# Altium project RANGE-FINDER-NODE.PrjPcb
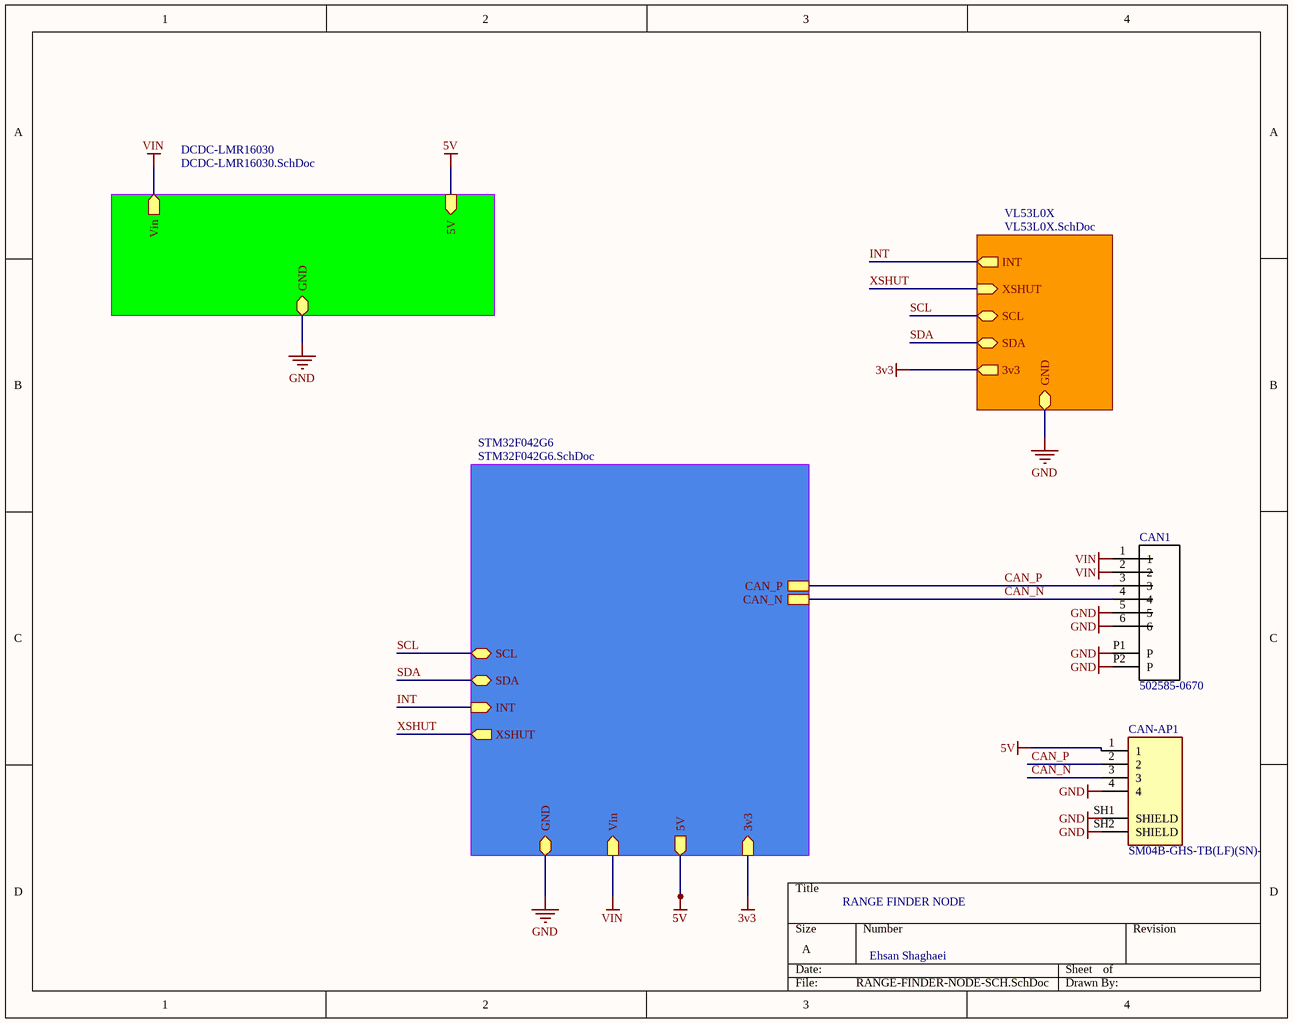
[diagram p0: RANGE-FINDER-NODE-SCH.SchDoc]
4 sheets, 45 parts. Net scope: hierarchical (ports join the sheet entries above them; power ports are global).
Board file: RANGE-FINDER-NODE-PCB.PcbDoc
Sheets:
  RANGE-FINDER-NODE-SCH.SchDoc
    STM32F042G6 = STM32F042G6.SchDoc
    DCDC-LMR16030 = DCDC-LMR16030.SchDoc
    VL53L0X = VL53L0X.SchDoc

## Sheet RANGE-FINDER-NODE-SCH.SchDoc: RANGE FINDER NODE
size A; Engineer: Ehsan Shaghaei; SheetNumber: 1; SheetTotal: 4

### Parts
CAN1  502585-0670  [MOLEX_502585-0670]
CAN-AP1  SM04B-GHS-TB(LF)(SN)-  [JST_SM04B-GHS-TB(LF)(SN)-]

### Sub-sheets
DCDC-LMR16030 = DCDC-LMR16030.SchDoc: GND (bidir), Vin (out), 5V (in)
STM32F042G6 = STM32F042G6.SchDoc: GND (bidir), Vin (in), 5V (out), 3v3 (in), SDA (bidir), SCL (bidir), XSHUT (out), INT (in), CAN_P, CAN_N
VL53L0X = VL53L0X.SchDoc: GND (bidir), 3v3 (out), SDA (bidir), SCL (bidir), XSHUT (in), INT (out)

### Nets
3v3: sheet STM32F042G6/3v3, sheet VL53L0X/3v3  [project net 3.3]
5V: CAN-AP1.1 ; sheet STM32F042G6/5V, sheet DCDC-LMR16030/5V
GND: CAN1.5 CAN1.6 CAN1.P1(P) CAN1.P2(P) CAN-AP1.4 CAN-AP1.SH1(SHIELD) CAN-AP1.SH2(SHIELD) ; sheet STM32F042G6/GND, sheet DCDC-LMR16030/GND, sheet VL53L0X/GND
Vin: CAN1.1 CAN1.2 ; sheet STM32F042G6/Vin, sheet DCDC-LMR16030/Vin
CAN_N: CAN1.4 CAN-AP1.3 ; sheet STM32F042G6/CAN_N
CAN_P: CAN1.3 CAN-AP1.2 ; sheet STM32F042G6/CAN_P
INT: sheet STM32F042G6/INT, sheet VL53L0X/INT
SCL: sheet STM32F042G6/SCL, sheet VL53L0X/SCL
SDA: sheet STM32F042G6/SDA, sheet VL53L0X/SDA
XSHUT: sheet STM32F042G6/XSHUT, sheet VL53L0X/XSHUT

### Library data of the parts
CAN1 = 502585-0670: 1.50mm Pitch, CLIK-Mate PCB Receptacle, Single Row, Surface Mount, Right-Angle, Tin Plating, Positive Lock, 6 Circuits, Natural; MF: Molex; System: Connector; MP: 502585-0670; Package: None; SnapEDA_Link: https://www.snapeda.com/parts/502494-0670/Molex/view-part/?ref=snap; Value: *; Type: SMD
CAN-AP1 = SM04B-GHS-TB(LF)(SN)-: Connector Header Surface Mount, Right Angle 4 position 0.049 _1.25mm_; MF: JST Sales; MP: SM04B-GHS-TB(LF)(SN); Package: None; Value: *; SnapEDA_Link: https://www.snapeda.com/parts/SM04B-GHS-TB%28LF%29%28SN%29-/JST%20Sales%20America%20Inc./view-part/2759740/?ref=snap; HelpURL: http://www.farnell.com/datasheets/2082975.pdf; System: Connector; ChipDip_Link: https://www.chipdip.ru/product/sm04b-ghs-tb-lf-sn-gh-1.25mm-header-side-ent

## Sheet STM32F042G6.SchDoc: STM32F042G6 Schematics
size A3; Revision: 2; SheetNumber: 3; SheetTotal: 4; Version: 1
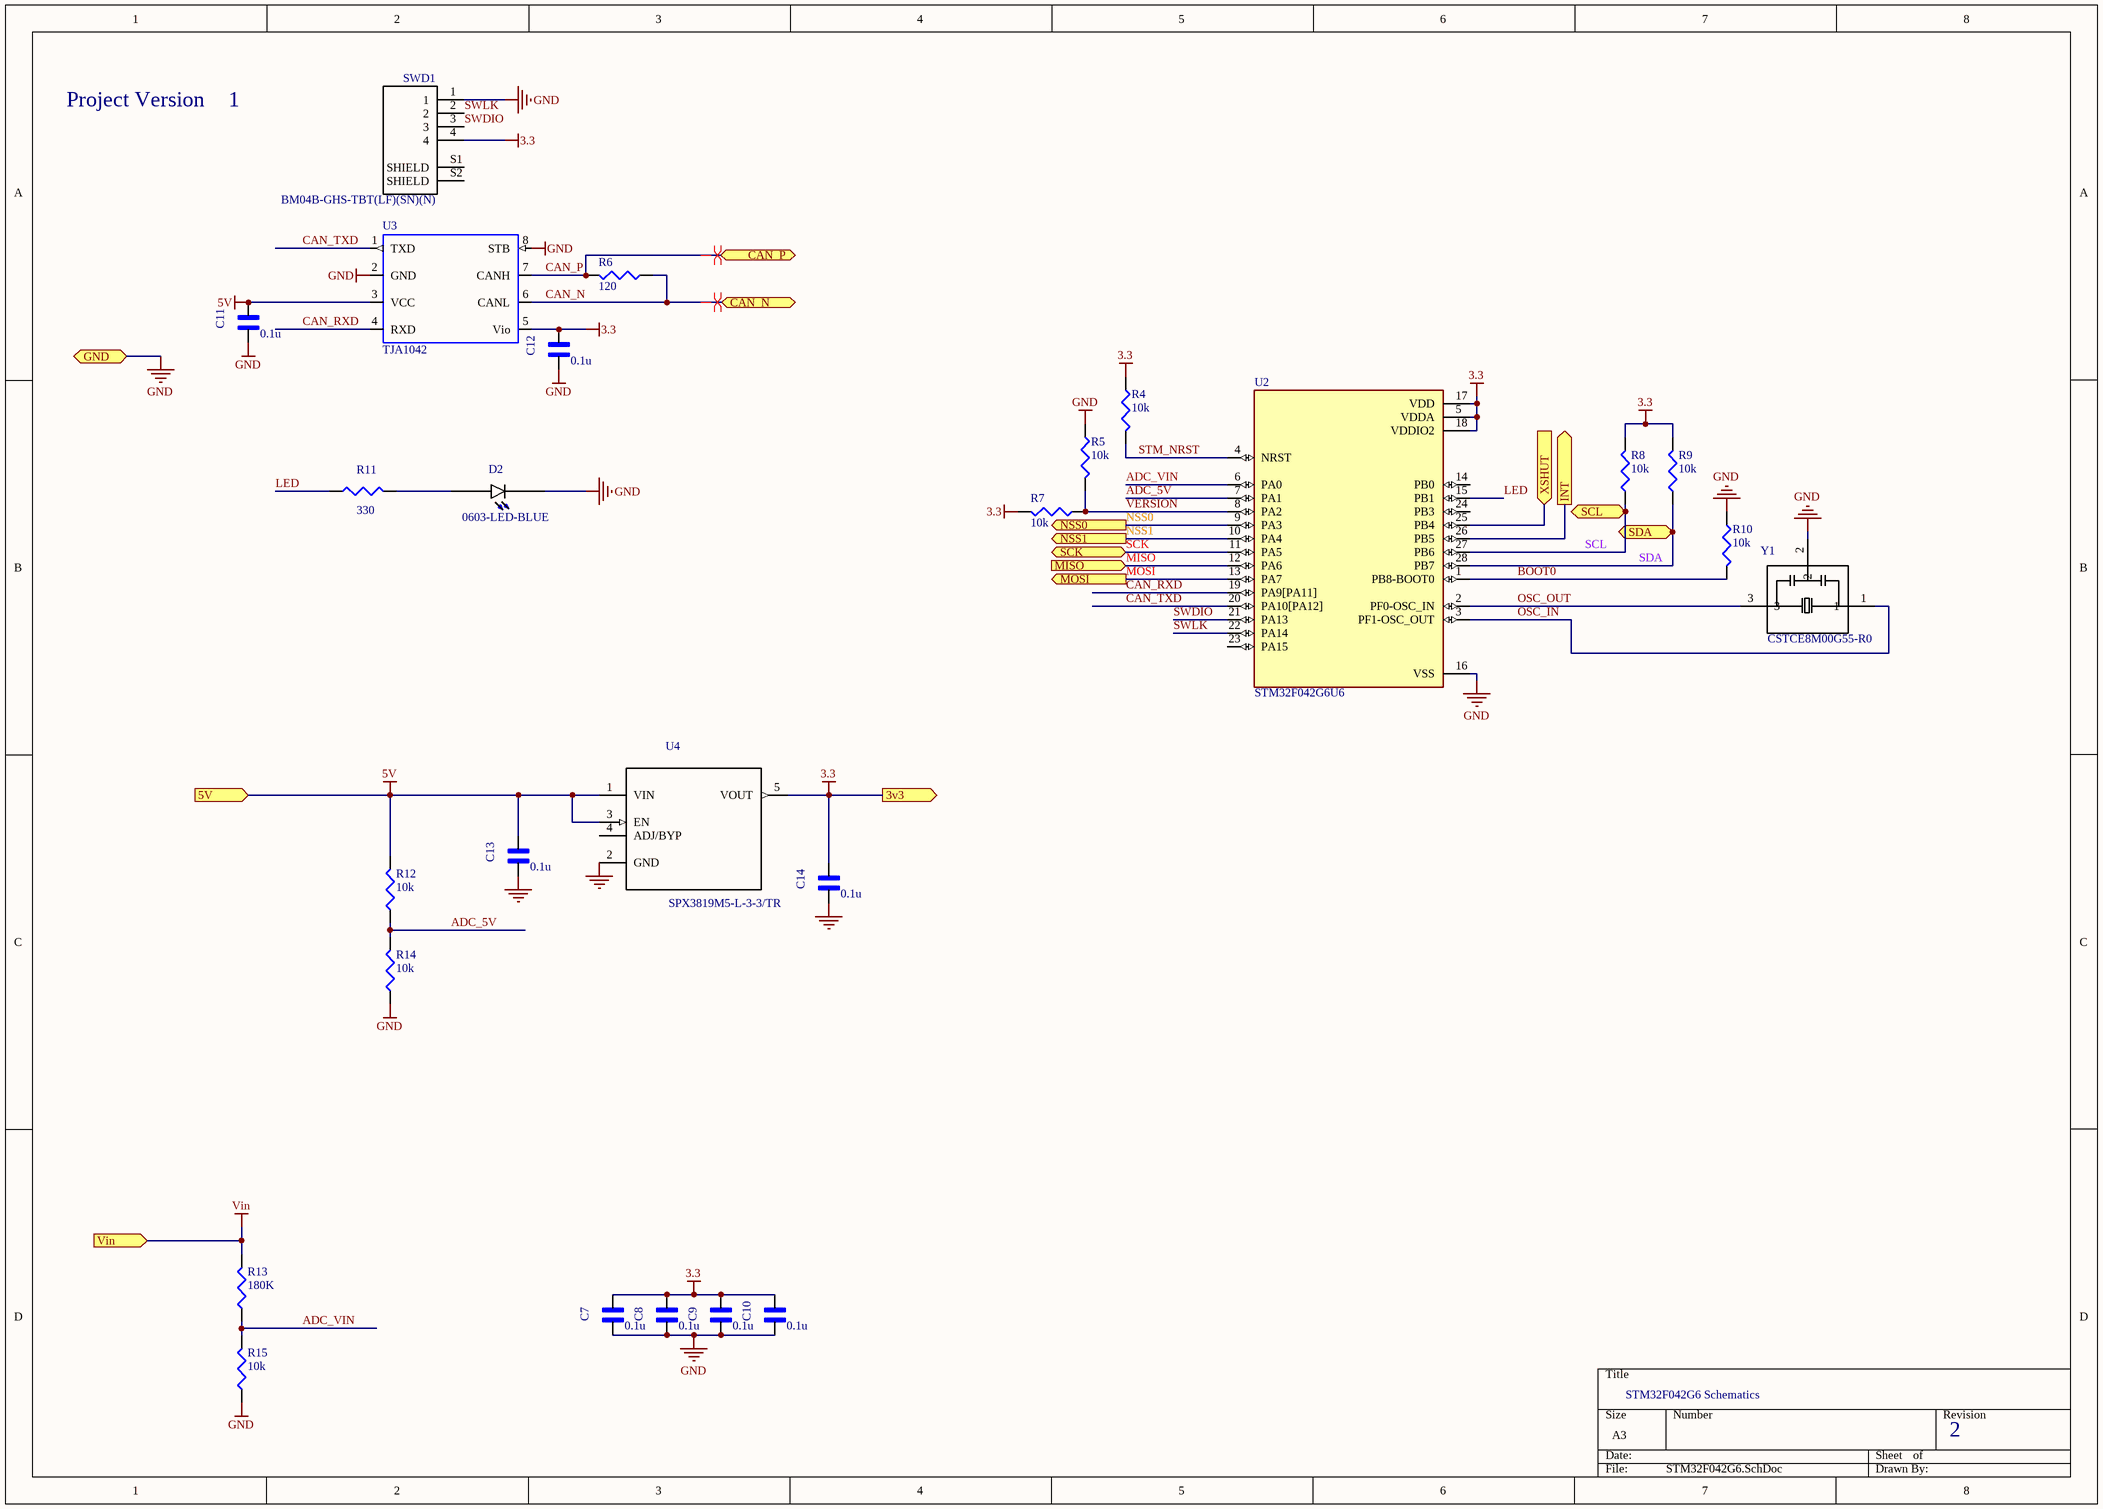
[diagram p1: STM32F042G6.SchDoc]

### Parts
C7  value 0.1u  [*CAPC1608X90]  (hidden comment: GX035C104MAT2-500)
C8  value 0.1u  [*CAPC1608X90]  (hidden comment: GX035C104MAT2-500)
C9  value 0.1u  [*CAPC1608X90]  (hidden comment: GX035C104MAT2-500)
C10  value 0.1u  [*CAPC1608X90]  (hidden comment: GX035C104MAT2-500)
C11  value 0.1u  [*CAPC1608X90]  (hidden comment: GX035C104MAT2-500)
C12  value 0.1u  [*CAPC1608X90]  (hidden comment: GX035C104MAT2-500)
C13  value 0.1u  [*CAPC1608X90]  (hidden comment: GX035C104MAT2-500)
C14  value 0.1u  [*CAPC1608X90]  (hidden comment: GX035C104MAT2-500)
D2  0603-LED-BLUE  [*LEDM1608X80_LTE-C1906R-14(Primary)]
R4  value 10k  [J1-0603]  (hidden comment: RC0603FR-0710KL)
R5  value 10k  [J1-0603]  (hidden comment: RC0603FR-0710KL)
R6  value 120  [J1-0603]  (hidden comment: Res3)
R7  value 10k  [J1-0603]  (hidden comment: RC0603FR-0710KL)
R8  value 10k  [J1-0603]  (hidden comment: RC0603FR-0710KL)
R9  value 10k  [J1-0603]  (hidden comment: RC0603FR-0710KL)
R10  value 10k  [J1-0603]  (hidden comment: RC0603FR-0710KL)
R11  value 330  [J1-0603]  (hidden comment: Res3)
R12  value 10k  [J1-0603]  (hidden comment: RC0603FR-0710KL)
R13  value 180K  [J1-0603]  (hidden comment: RC0603FR-0710KL)
R14  value 10k  [J1-0603]  (hidden comment: RC0603FR-0710KL)
R15  value 10k  [J1-0603]  (hidden comment: RC0603FR-0710KL)
SWD1  BM04B-GHS-TBT(LF)(SN)(N)  [JST_PAD]
U2  STM32F042G6U6  [STM32F042G6U6_UFQFPN4x4]
U3  TJA1042  [SOT782-1]
U4  SPX3819M5-L-3-3/TR  [*SOT95P280X145-5N]
Y1  CSTCE8M00G55-R0  [*OSC_CSTCE8M00G55-R0]

### Ports
3v3 (out), 5V (in), CAN_N (bidir), CAN_P (bidir), GND (bidir), INT (out), MISO (in), MOSI (out), NSS0 (out), NSS1 (out), SCK (bidir), SCL (bidir), SDA (bidir), Vin (in), XSHUT (in)

### Nets
3.3: C7.1 C8.1 C9.1 C10.1 C12.1 C14.1 R4.1 R7.2 R8.2 R9.2 SWD1.4 U2.5(VDDA) U2.17(VDD) U2.18(VDDIO2) U3.5(Vio) U4.5(VOUT) ; port 3v3
5V: C11.1 C13.1 R12.2 U3.3(VCC) U4.1(VIN) U4.3(EN) ; port 5V
GND: C7.2 C8.2 C9.2 C10.2 C11.2 C12.2 C13.2 C14.2 D2.C R5.1 R10.1 R14.1 R15.1 SWD1.1 U2.16(VSS) U3.2(GND) U3.8(STB) U4.2(GND) Y1.2 ; port GND
Vin: R13.2 ; port Vin
ADC_5V: R12.1 R14.2 U2.7(PA1)
ADC_VIN: R13.1 R15.2 U2.6(PA0)
BOOT0: R10.2 U2.1(PB8-BOOT0)
CAN_N: R6.1 U3.6(CANL) ; port CAN_N
CAN_P: R6.2 U3.7(CANH) ; port CAN_P
CAN_RXD: U2.19(PA9[PA11]) U3.4(RXD)
CAN_TXD: U2.20(PA10[PA12]) U3.1(TXD)
INT: U2.26(PB5) ; port INT
LED: R11.1 U2.15(PB1)
MISO: U2.12(PA6) ; port MISO
MOSI: U2.13(PA7) ; port MOSI
NSS0: U2.9(PA3) ; port NSS0
NSS1: U2.10(PA4) ; port NSS1
OSC_IN: U2.3(PF1-OSC_OUT) Y1.1
OSC_OUT: U2.2(PF0-OSC_IN) Y1.3
SCK: U2.11(PA5) ; port SCK
SCL: R8.1 U2.27(PB6) ; port SCL
SDA: R9.1 U2.28(PB7) ; port SDA
STM_NRST: R4.2 U2.4(NRST)
SWDIO: SWD1.3 U2.21(PA13)
SWLK: SWD1.2 U2.22(PA14)
VERSION: R5.2 R7.1 U2.8(PA2)
XSHUT: U2.25(PB4) ; port XSHUT
NetD2_A: D2.A R11.2

Not connected (* = marked no-connect by the designer): SWD1 S1(SHIELD) S2(SHIELD); U2 14(PB0) 23(PA15) 24(PB3); U4 4(ADJ/BYP)

### Layout directives
differential pair: CAN_N, CAN_P

### Notes on the sheet
- Project Version

### Library data of the parts
C7-C12 = GX035C104MAT2-500: Cap Thin Film 0.1uf 50v 0603; MF: AVX; MP: GX035C104MAT2-500 or CL10B104JB8NNNC; Pacage Metric: 1608; Type: SMD; Package: 0603 AVX; SnapEDA_Link: https://www.snapeda.com/parts/GX035C104MAT2-500/AVX/view-part/?ref=snap
C13 C14 = GX035C104MAT2-500: Cap Thin Film 0.1uf 50v 0603; MF: AVX; Pacage Metric: 1608; Type: SMD; Package: 0603 AVX; MP: GX035C104MAT2-500; SnapEDA_Link: https://www.snapeda.com/parts/GX035C104MAT2-500/AVX/view-part/?ref=snap
D2 = LTE-C1906R-14: LED IrLED Chip LED 2-Pin SMD T/R; Package: 0603 Lite-On; MP: 0603-LED-BLUE; SnapEDA_Link: https://www.snapeda.com/parts/LTE-C1906R-14/Lite-On%20Inc./view-part/?ref=snap; Value: *; Type: SMD
R4 R5 R7-R10 R12-R15 = RC0603FR-0710KL: 10 kOhms 1 0.1 W 1 10 W Chip Resistor 0603 1608 Metric Thick Film; Pacage Metric: 1608; MF: Yageo or NXP; MP: 10K 1% 0603; ChipDip_Link: https://www.chipdip.ru/product0/9000079736; HelpURL: https://www.chipdip.ru/product0/9000079736; Package: R0603; Type: SMD; SnapEDA_Link: https://www.snapeda.com/parts/RC0603FR-0710KL/Yageo/view-part/?ref=dk&t=RC0603FR-0710KL&con_ref=None
R6 = Res3: 120 Ohms 1 0.1 W 1 10 W Chip Resistor 0603 1608 Metric Thick Film; Pacage Metric: 1608; MP: RC0603FR-07120RL; ChipDip_Link: https://www.chipdip.ru/product0/9000079618; HelpURL: https://www.chipdip.ru/product0/9000079618; Package: R0603; Type: SMD
R11 = Res3: Resistor; Pacage Metric: 1608; MP: RC0603FR-07330RL; ChipDip_Link: https://www.chipdip.ru/product0/9000079628; HelpURL: https://www.chipdip.ru/product0/9000079628; Package: R0603; Type: SMD
SWD1 = BM04B-GHS-TBT(LF)(SN)(N): Conn Shrouded Header HDR 4 POS 1.25mm Solder ST SMD Reel; MF: JST Sales; MP: SM04B-GHS-TB(LF)(SN); Instructions: Do not install; System: Connector; SnapEDA_Link: https://www.snapeda.com/parts/BM04B-GHS-TBT%28LF%29%28SN%29%28N%29/JST%20Sales%20America%20Inc./view-part/?ref=snap; Package: None; Value: *; Type: SMD
U2 = STM32F042G6U6: ARMÂ® CortexÂ®-M0 STM32F0 Microcontroller IC 32-Bit 48MHz 32KB _32K x 8_ FLASH 28-UFQFPN _4x4_; MF: STMicroelectronics; designer: Ehsan Shaghaei; Package: UFQFN-28 STMicroelectronics; Availability: Unavailable; SnapEDA_Link: https://www.snapeda.com/parts/STM32F042G6U6/STMicroelectronics/view-part/225452/?ref=snap; MP: STM32F042G6U6; Price: None; Value: *; datasheet: https://static.chipdip.ru/lib/914/DOC005914773.pdf; chipdip_link: https://www.chipdip.ru/product/stm32f042g6u6
U3 = TJA1042: 1/1 Transceiver Half CANbus 8-SO; MF: NXP USA; SnapEDA_Link: https://www.snapeda.com/parts/TJA1042/NXP%20USA%20Inc./view-part/900919/?ref=snap; Value: *; MP: TJA1042; Package: VDFN-8 NXP USA; ChipDip_Link: https://www.chipdip.ru/product1/8002840332; HelpURL: https://static.chipdip.ru/lib/583/DOC001583059.pdf; Type: SMD
U4 = SPX3819M5-L: Low Dropout Voltage Regulator, Adjustable 0.5A, В±1%, 2.5 to 16 Vin, 5-Pin SOT-23; MF: MaxLinear, Inc.; Value: 3V3; MP: SPX3819M5-L-3-3/TR; Package: SOT-23-5 Exar; SnapEDA_Link: https://www.snapeda.com/parts/SPX3819M5-L/MaxLinear%2C%20Inc./view-part/?ref=snap; Type: SMD; ChipDip_Link: https://www.chipdip.ru/product1/8003455237; HelpURL: http://www.farnell.com/datasheets/2614478.pdf
Y1 = CSTCE8M00G55-R0: Ceramic Resonator 8MHz ??0.5% _Tol_ ??0.2% _Stability_ 33pF 40Ohm 3-Pin CSMD T/R; MF: Murata; MP: CSTCE8M00G55-R0; Package: SMD-3 Murata; SnapEDA_Link: https://www.snapeda.com/parts/CSTCE8M00G55-R0/Murata%20Electronics%20North%20America/view-part/?ref=snap; Value: *; ChipDip_Link: https://www.chipdip.ru/product1/8001783721; HelpURL: https://www.murata.com/en-eu/api/pdfdownloadapi?cate=&partno=CSTCE8M00G55-R0; Type: SMD

## Sheet DCDC-LMR16030.SchDoc
size A3; Revision: 8; SheetNumber: 2; SheetTotal: 4
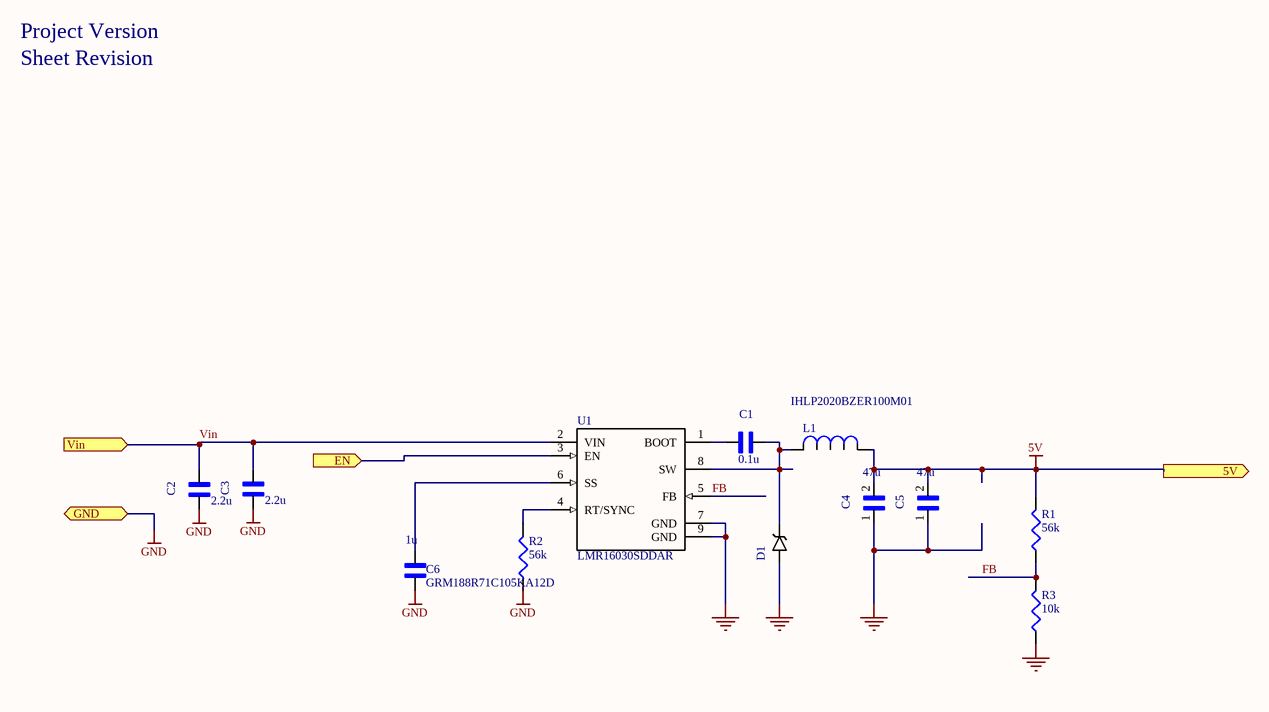
[diagram p2: DCDC-LMR16030.SchDoc]

### Parts
C1  value 0.1u  [*CAPC1608X90]  (hidden comment: GX035C104MAT2-500)
C2  value 2.2u  [*CAP3216X125N]  (hidden comment: GRM31CR71H225KA88L)
C3  value 2.2u  [*CAP3216X125N]  (hidden comment: GRM31CR71H225KA88L)
C4  value 47u  [*CAPC3216X125N]  (hidden comment: GRM31CR61A476KE15L)
C5  value 47u  [*CAPC3216X125N]  (hidden comment: GRM31CR61A476KE15L)
C6  GRM188R71C105KA12D  value 1u  [CAPC1608X90N]
D1  SK56  [*SMB_P6SMB62AT3G(Primary)]  (value not drawn)
L1  IHLP2020BZER100M01  [IHLP]
R1  value 56k  [J1-0603]  (hidden comment: Res3)
R2  value 56k  [J1-0603]  (hidden comment: Res3)
R3  value 10k  [J1-0603]  (hidden comment: RC0603FR-0710KL)
U1  LMR16030SDDAR  [*SOIC127P600X170-9N - duplicate]

### Ports
5V (out), EN (in), GND (bidir), Vin (in)

### Nets
5V: C4.2 C5.2 L1.1 R1.2 ; port 5V
GND: C2.2 C3.2 C4.1 C5.1 C6.1 D1.A R2.1 R3.1 U1.7(GND) U1.9(GND) ; port GND
Vin: C2.1 C3.1 U1.2(VIN) ; port Vin
FB: R1.1 R3.2 U1.5(FB)
NetC1_1: C1.1 D1.C L1.2 U1.8(SW)
NetC1_2: C1.2 U1.1(BOOT)
NetC6_2: C6.2 U1.6(SS)
NetR2_2: R2.2 U1.4(RT/SYNC)
NetU1_3: U1.3(EN) ; port EN

### Notes on the sheet
- Project Version
- Sheet Revision

### Library data of the parts
C1 = GX035C104MAT2-500: as C7 on sheet STM32F042G6; Package: 0603 AVX; SnapEDA_Link: https://www.snapeda.com/parts/GX035C104MAT2-500/AVX/view-part/?ref=snap
C2 C3 = GRM31CR71H225KA88L: 1206 2.2 uF 50 V В±10% Tolerance X7R SMT Multilayer Ceramic Capacitor; MF: Murata Electronics; Type: SMD; Package: 1206 Murata; SnapEDA_Link: https://www.snapeda.com/parts/GRM31CR71H225KA88L/Murata%20Electronics%20North%20America/view-part/?ref=snap; MP: GRM31CR71H225KA88L
C4 C5 = GRM31CR61A476KE15L: Multilayer Ceramic Capacitor, GRM Series, 47 - F, - 10%, X5R, 10 V, 1206 [3216 Metric]; MF: Murata Electronics; Type: SMD; Package: 1206 Murata Electronics; MP: GRM31CR61A476KE15L; SnapEDA_Link: https://www.snapeda.com/parts/GRM31CR61A476KE15L/Murata%20Electronics%20North%20America/view-part/?ref=snap
C6 = GRM188R71C105KA12D: SMD Capacitor X7R(EIA) with Capacitance: 1.0uF Tol. 10%. Rated Voltage: 16Vdc; MF: Murata Electronics; Pacage Metric: 1608; MP: GRM188R71C105KA12D; SnapEDA_Link: https://www.snapeda.com/parts/GRM188R71C105KA12D/Murata%20Electronics%20North%20America/view-part/228340/?ref=snap; Package: 0603; ChipDip_Link: https://www.chipdip.ru/product/grm188r71c105ka12d; HelpURL: https://static.chipdip.ru/lib/428/DOC005428493.pdf; Type: SMD
D1 = SK56: Диод Шоттки 5А 60В [SMB / DO-214AA]; MF: Littelfuse Inc.; Type: SMD; MP: SK56; Package: DO-214 Littelfuse; SnapEDA_Link: https://www.snapeda.com/parts/P6SMB62AT3G/Littelfuse%20Inc./view-part/?ref=snap; Value: *; ChipDip_Link: https://www.chipdip.ru/product/sk56
L1 = IHLP2020BZER100M01: 10ÂµH Shielded Molded Inductor 2.3A 199mOhm Max Nonstandard; MF: Vishay Dale; Type: SMD; SnapEDA_Link: https://www.snapeda.com/parts/IHLP2020BZER100M01/Vishay%20Dale/view-part/44808/?ref=snap; MP: IHLP2020BZER100M01; Value: *; Package: Nonstandard Vishay; HelpURL: http://www.vishay.com/docs/34253/ihlp-2020bz-01.pdf; ChipDip_Link: https://www.chipdip.ru/product/ihlp2020bzer100m11-inductor-ihlp-smd-2020-10
R1 R2 = Res3: Resistor; Pacage Metric: 1608; MP: RC0603FR-0756KL; ChipDip_Link: https://www.chipdip.ru/product0/9000079754; HelpURL: https://www.chipdip.ru/product0/9000079754; Package: R0603; Type: SMD
R3 = RC0603FR-0710KL: as R4 on sheet STM32F042G6; ChipDip_Link: https://www.chipdip.ru/product0/9000079736; HelpURL: https://www.chipdip.ru/product0/9000079736; Package: R0603; Type: SMD; SnapEDA_Link: https://www.snapeda.com/parts/RC0603FR-0710KL/Yageo/view-part/?ref=dk&t=RC0603FR-0710KL&con_ref=None
U1 = LMR16030SDDAR: LMR16030SDDAR, Conv DC-DC 4.3V to 60V Step Down Single-Out 1V to 50V 3A Automotive 8-Pin HSOP EP T/R; MF: Texas Instruments; SnapEDA_Link: https://www.snapeda.com/parts/TPS54560DDA/Texas%20Instruments/view-part/?ref=snap; MP: LMR16030SDDAR; Package: PowerSOIC-8 Texas Instruments; Value: *; Type: SMD; ChipDip_Link: https://www.chipdip.ru/product1/8003448566; HelpURL: https://www.ti.com/lit/ds/symlink/lmr16030.pdf

## Sheet VL53L0X.SchDoc
size A; Author: Ehsan Shaghaei; Engineer: Ehsan Shaghaei; Organization: Innopolis University; SheetNumber: 4; SheetTotal: 4
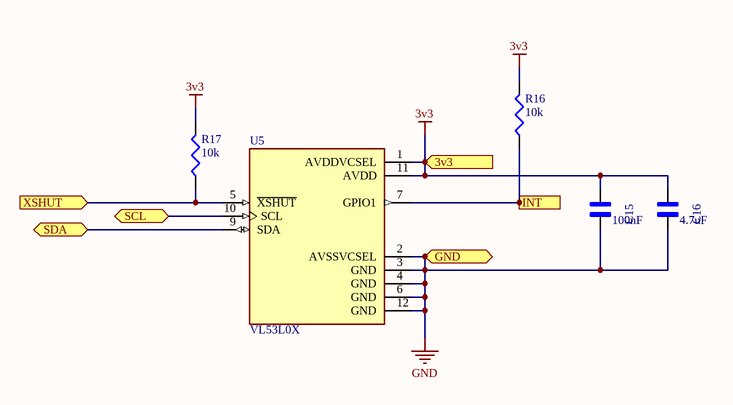
[diagram p3: VL53L0X.SchDoc]

### Parts
C15  value 100nF  [*CAPC1608X90]  (hidden comment: GX035C104MAT2-500)
C16  value 4.7uF  [*CAPC1608X90]  (hidden comment: GX035C104MAT2-500)
R16  value 10k  [J1-0603]  (hidden comment: RC0603FR-0710KL)
R17  value 10k  [J1-0603]  (hidden comment: RC0603FR-0710KL)
U5  VL53L0X  [SENSOR_VL53L0X]

### Ports
3v3 (in), GND (bidir), INT (out), SCL (bidir), SDA (bidir), XSHUT (in)

### Nets
3v3: C15.2 C16.2 R16.2 R17.2 U5.1(AVDDVCSEL) U5.11(AVDD) ; port 3v3  [project net 3.3]
GND: C15.1 C16.1 U5.2(AVSSVCSEL) U5.3(GND) U5.4(GND) U5.6(GND) U5.12(GND) ; port GND
INT: R16.1 U5.7(GPIO1) ; port INT
SCL: U5.10(SCL) ; port SCL
SDA: U5.9(SDA) ; port SDA
XSHUT: R17.1 U5.5(~{XSHUT}) ; port XSHUT

### Library data of the parts
C15 C16 = GX035C104MAT2-500: as C7 on sheet STM32F042G6; Package: 0603 AVX; SnapEDA_Link: https://www.snapeda.com/parts/GX035C104MAT2-500/AVX/view-part/?ref=snap
R16 R17 = RC0603FR-0710KL: as R4 on sheet STM32F042G6; ChipDip_Link: https://www.chipdip.ru/product0/9000079736; HelpURL: https://www.chipdip.ru/product0/9000079736; Package: R0603; Type: SMD; SnapEDA_Link: https://www.snapeda.com/parts/RC0603FR-0710KL/Yageo/view-part/?ref=dk&t=RC0603FR-0710KL&con_ref=None
U5 = VL53L0X: VL53L0X - Light, 3D Time-of-Flight _ToF_ Sensor Evaluation Board; MF: STMicroelectronics; designer: Ehsan Shaghaei; MP: VL53L0X; Package: None; Price: None; Availability: Unavailable; SnapEDA_Link: https://www.snapeda.com/parts/VL53L0X/STMicroelectronics/view-part/473967/?ref=snap; Value: *; chipdip_link: https://www.chipdip.ru/product/vl53l0cxv0dh-1-stm; datasheet: http://www.farnell.com/datasheets/2291222.pdf

## Nets that join several sheets
3.3: STM32F042G6 (16 pins), VL53L0X (6 pins)
5V: RANGE-FINDER-NODE-SCH (CAN-AP1.1), STM32F042G6 (6 pins), DCDC-LMR16030 (C4.2 C5.2 L1.1 R1.2)
GND: RANGE-FINDER-NODE-SCH (7 pins), STM32F042G6 (19 pins), DCDC-LMR16030 (10 pins), VL53L0X (7 pins)
Vin: RANGE-FINDER-NODE-SCH (CAN1.1 CAN1.2), STM32F042G6 (R13.2), DCDC-LMR16030 (C2.1 C3.1 U1.2)
CAN_N: RANGE-FINDER-NODE-SCH (CAN1.4 CAN-AP1.3), STM32F042G6 (R6.1 U3.6)
CAN_P: RANGE-FINDER-NODE-SCH (CAN1.3 CAN-AP1.2), STM32F042G6 (R6.2 U3.7)
INT: STM32F042G6 (U2.26), VL53L0X (R16.1 U5.7)
SCL: STM32F042G6 (R8.1 U2.27), VL53L0X (U5.10)
SDA: STM32F042G6 (R9.1 U2.28), VL53L0X (U5.9)
XSHUT: STM32F042G6 (U2.25), VL53L0X (R17.1 U5.5)